# Altium schematic sheet QCopterFC_LED_Sch.SchDoc
size A4
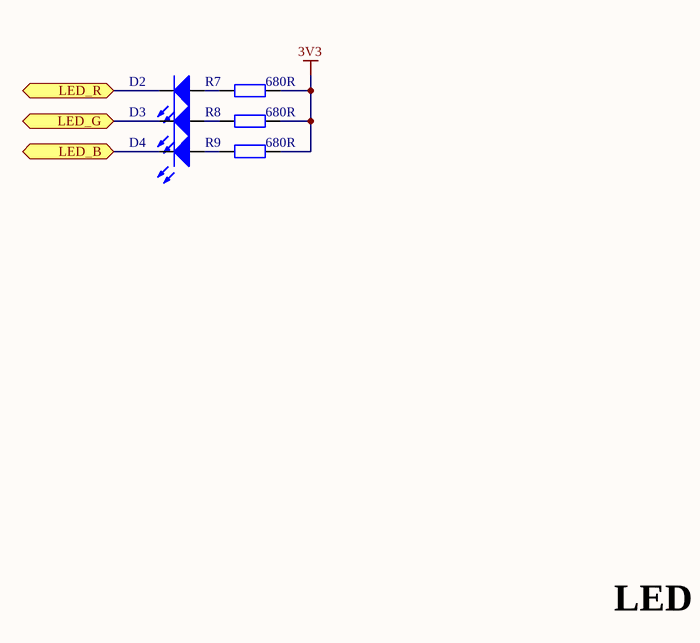
[diagram p0: QCopterFC_LED_Sch.SchDoc]

## Parts
D2  LED_0603_RED  [LED_0603_RED]  (value not drawn)
D3  LED_0603_GREEN  [LED_0603_GREEN]  (value not drawn)
D4  LED_0603_BLUE  [LED_0603_BLUE]  (value not drawn)
R7  value 680R  [RES_0603]  (hidden comment: Res_0603)
R8  value 680R  [RES_0603]  (hidden comment: Res_0603)
R9  value 680R  [RES_0603]  (hidden comment: Res_0603)

## Ports
LED_B, LED_G, LED_R

## Nets
3V3: R7.2 R8.2 R9.2
LED_B: D4.2(K) ; port LED_B
LED_G: D3.2(K) ; port LED_G
LED_R: D2.2(K) ; port LED_R
NetD2_1: D2.1(A) R7.1
NetD3_1: D3.1(A) R8.1
NetD4_1: D4.1(A) R9.1

## Notes on the sheet
- LED

## Library data of the parts
D2 = LED_0603_RED: LED
D3 = LED_0603_GREEN: LED
D4 = LED_0603_BLUE: LED
R7-R9 = Res_0603: Resistor